# Altium schematic sheet 01-POWER.SchDoc: *NGUON4V4
size A4; SheetNumber: 1; SheetTotal: 4
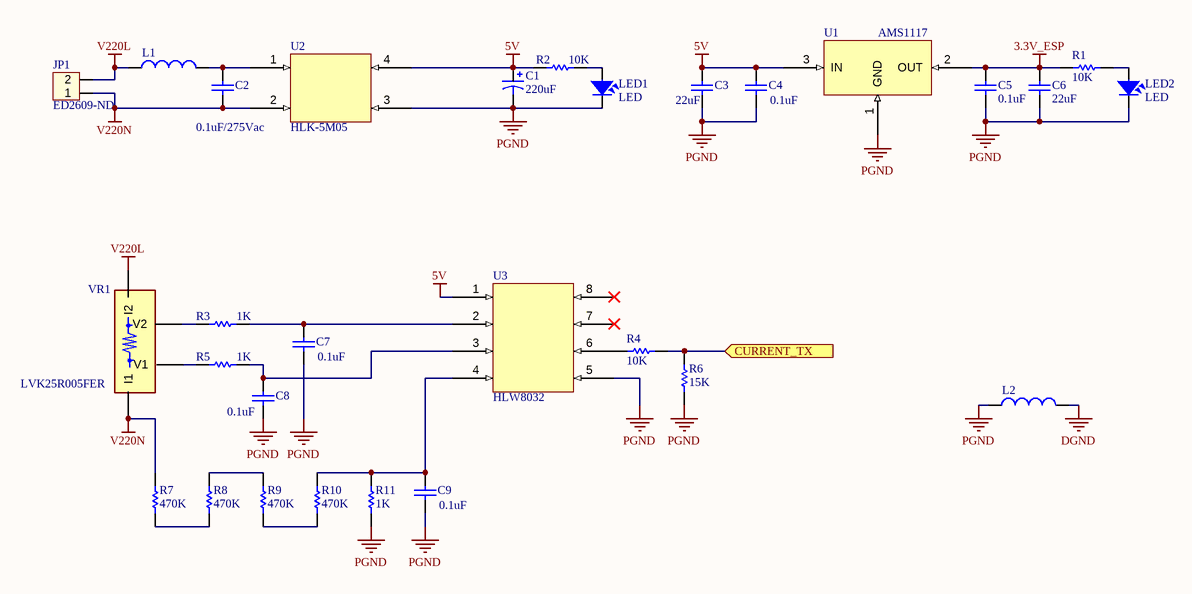
[diagram p0: 01-POWER.SchDoc]

## Parts
C1  220uF  [CAP ALU CASE G SMD]
C2  0.1uF/275Vac  [FilM_Cap]
C3  22uF  [CAP_CERA_C2012(CC0805INCH)]
C4  0.1uF  [CAP_CERA_C2012(CC0805INCH)]
C5  0.1uF  [CAP_CERA_C2012(CC0805INCH)]
C6  22uF  [CAP_CERA_C2012(CC0805INCH)]
C7  0.1uF  [Cap Ceramic 0603 SMD]
C8  0.1uF  [Cap Ceramic 0603 SMD]
C9  0.1uF  [Cap Ceramic 0603 SMD]
JP1  ED2609-ND  [DOMINO_OSTTC_2P]
L1  744212820  [WE-SL1]  (value not drawn)
L2  ASPI-7318-8R2M-TCT-ND  [ASPI-7318-8R2M-TCT-ND]  (value not drawn)
LED1  LED  [Led 0805G]
LED2  LED  [Led 0805G]
R1  10K  [Res 0603 SMD]
R2  10K  [Res 0603 SMD]
R3  1K  [Res 0603 SMD]
R4  10K  [Res 0603 SMD]
R5  1K  [Res 0603 SMD]
R6  15K  [Res 0603 SMD]
R7  470K  [Res 0603 SMD]
R8  470K  [Res 0603 SMD]
R9  470K  [Res 0603 SMD]
R10  470K  [Res 0603 SMD]
R11  1K  [Res 0603 SMD]
U1  AMS1117  [SOT230P700X180-4N]
U2  HLK-5M05  [CONV_HLK-5M05]
U3  HLW8032  [SOIC127P600X175-8N]
VR1  LVK25R005FER  [LVK25R005FER]

## Ports
CURRENT_TX (in)

## Nets
3.3V_ESP: C5.2 C6.2 R1.1 U1.2(OUT)
5V: C1.1 C3.2 C4.2 R2.1 U1.3(IN) U2.4 U3.1
DGND: L2.2
PGND: C1.2 C3.1 C4.1 C5.1 C6.1 C7.1 C8.1 C9.1 L2.1 LED1.2 LED2.2 R6.2 R11.1 U1.1(GND) U2.3 U3.5
V220L: JP1.2 L1.1 VR1.2(I2)
V220N: C2.1 JP1.1 R7.1 U2.2 VR1.1(I1)
CURRENT_TX: R4.2 R6.1 ; port CURRENT_TX
NetC2_2: C2.2 L1.2 U2.1
NetC7_2: C7.2 R3.1 U3.2
NetC8_2: C8.2 R5.1 U3.3
NetC9_2: C9.2 R10.1 R11.2 U3.4
NetLED1_1: LED1.1 R2.2
NetLED2_1: LED2.1 R1.2
NetR3_2: R3.2 VR1.4(V2)
NetR4_1: R4.1 U3.6
NetR5_2: R5.2 VR1.3(V1)
NetR7_2: R7.2 R8.2
NetR8_1: R8.1 R9.1
NetR9_2: R9.2 R10.2

Not connected (* = marked no-connect by the designer): U3 7* 8*

## Notes on the sheet
- DWG. NO.
- REV.
- SHT.
- THIS DOCUMENT AND THE DATA DISCLOSED HEREIN OR HEREWITH IS THE PROPERTY OF ALTIUM LIMITED AND MAY BE FREELY DISTRIBUTED IN WHOLE. NO RIGHTS ARE RESERVED OR EXPRESS OR IMPLIED WARANTEE GIVEN.
- REVISION
- DESCRIPTION
- DATE
- APPROVED
- ENG:
- APPROVALS
- PROJECT
- DSN:
- CHK:
- REFERENCE DOCUMENTS
- PROJECT REVISION:
- TITLE
- DOCUMENT REVISION:
- DESIGN ITEM:
- BOM:
- FAB DWG:
- PCB DWG:
- ASSY DWG:
- SCALE:
- SIZE
- B
- CAGE CODE
- FILE NAME
- DWG NO.
- SHEET
- OF
- REV

## Library data of the parts
C1 = 330uF/50V/ALU12.5X20mm/20%/7000Hrs: CAP ALU 220UF 20% 50V SMD; Manufacturer: Nichicon; Manufacturer Part Number: UPW1J331MHD; Lifetime @ Temp.: 7000 Hrs @ 105°C; Polarization: Polar; Ripple Current - Low Frequency: 838.5mA @ 120Hz; Ripple Current - High Frequency: 1.29A @ 100kHz; RoHS: RoHS Compliant; Category: Capacitors; Packaging: Bulk; Part Status: Active; Tolerance: ±20%; ESR (Equivalent Series Resistance): -; Operating Temperature: -55°C ~ 105°C; Applications: General Purpose; Lead Spacing: 0.197" (5.00mm); Size / Dimension: 0.492" Dia (12.50mm); Height - Seated (Max): 0.787" (20.00mm); Surface Mount Land Size: -; Mounting Type: Through Hole; Package / Case: Radial, Can; ComponentLink1URL: http://nichicon-us.com/english/products/pdfs/e-upw.pdf; ComponentLink1Description: http://nichicon-us.com/english/products/pdfs/e-upw.pdf; Supplier 1: Digi-Key; Supplier Part Number 1: PCE5121TR-ND
C2 = 0.1uF/50V/C0603/10%: 0.1 µF Film Capacitor 275V - Polypropylene (PP), Metallized Radial; Manufacturer: Murata; ComponentLink1URL: http://www.murata.com/~/media/webrenewal/support/library/catalog/products/capacitor/mlcc/c02e.ashx; ComponentLink1Description: http://www.murata.com/~/media/webrenewal/support/library/catalog/products/capacitor/mlcc/c02e.ashx; Digikey: 490-9961-1-ND
C3 C6 = 0.1uF/50V/C0603/10%: 22µF ±20% 25V Ceramic Capacitor X5R 0805 (2012 Metric); Manufacturer: Tariff Applied; ComponentLink1URL: http://www.murata.com/~/media/webrenewal/support/library/catalog/products/capacitor/mlcc/c02e.ashx; ComponentLink1Description: http://www.murata.com/~/media/webrenewal/support/library/catalog/products/capacitor/mlcc/c02e.ashx; Digikey: 1276-2908-1-ND
C4 C5 = 0.1uF/50V/C0603/10%: 0.1µF ±10% 25V Ceramic Capacitor X7R 0805 (2012 Metric); ComponentLink1URL: http://www.murata.com/~/media/webrenewal/support/library/catalog/products/capacitor/mlcc/c02e.ashx; ComponentLink1Description: http://www.murata.com/~/media/webrenewal/support/library/catalog/products/capacitor/mlcc/c02e.ashx; Digikey: 478-3755-1-ND
C7-C9 = 0.1uF/50V/C0603/10%: CAP CER 0.1UF 50V 10% X7R 0603; Manufacturer: Murata Electronics North America; Manufacturer Part Number: GRM188R71H104KA93D; Capacitance: 0.1µF; RoHS: RoHS Compliant; Category: Capacitors; Packaging: Tape & Reel (TR); Tolerance: ±10%; Voltage - Rated: 50V; Temperature Coefficient: X7R; Mounting Type: Surface Mount, MLCC; Operating Temperature: -55°C ~ 125°C; Applications: General Purpose; Ratings: -; Package / Case: 0603 (1608 Metric); Size / Dimension: 0.063" L x 0.031" W (1.60mm x 0.80mm); Height - Seated (Max): -; Thickness (Max): 0.035" (0.90mm); Lead Spacing: -; Features: -; Lead Style: -; ComponentLink1URL: http://www.murata.com/~/media/webrenewal/support/library/catalog/products/capacitor/mlcc/c02e.ashx; ComponentLink1Description: http://www.murata.com/~/media/webrenewal/support/library/catalog/products/capacitor/mlcc/c02e.ashx; Supplier 1: Digi-Key; Supplier Part Number 1: 490-1519-1-ND
JP1 = Con2: 2 Position Wire to Board Terminal Block Horizontal with Board 0.200" (5.08mm) Through Hole; Value: Connector 2; Digikey: ED2609-ND
L1 L2 = Inductor: Sensible value10-15mH，current / 70-500mA; Digikey: ASPI-7318-8R2M-TCT-ND
LED1 LED2 = LED: LED Single colour Green and Red; Value: LED 3 ly Single Colour
R1 R2 R4 = 15K/R0603/1%: RES SMD 10K OHM 1% 1/10W 0603; Manufacturer: Yageo; Manufacturer Part Number: RC0603FR-0715KL; Resistance (Ohms): 15k; Power (Watts): 0.1W, 1/10W; Temperature Coefficient: ±100ppm/°C; RoHS: RoHS Compliant; Category: Resistors; Packaging: Digi-Reel®; Tolerance: ±1%; Composition: Thick Film; Features: Moisture Resistant; Operating Temperature: -55°C ~ 155°C; Package / Case: 0603 (1608 Metric); Supplier Device Package: 0603; Size / Dimension: 0.063" L x 0.031" W (1.60mm x 0.80mm); Height: 0.022" (0.55mm); Number of Terminations: 2; ComponentLink1URL: http://www.yageo.com/NewPortal/yageodocoutput?fileName=/pdf/R-Chip/PYu-RC_Group_51_RoHS_L_3.pdf; ComponentLink1Description: http://www.yageo.com/NewPortal/yageodocoutput?fileName=/pdf/R-Chip/PYu-RC_Group_51_RoHS_L_3.pdf; Supplier 1: Digi-Key; Supplier Part Number 1: 311-15.0KHRCT-ND
R3 R5 R11 = 15K/R0603/1%: RES SMD 1K OHM 1% 1/10W 0603; Manufacturer: Yageo; Manufacturer Part Number: RC0603FR-0715KL; Resistance (Ohms): 15k; Power (Watts): 0.1W, 1/10W; Temperature Coefficient: ±100ppm/°C; RoHS: RoHS Compliant; Category: Resistors; Packaging: Digi-Reel®; Tolerance: ±1%; Composition: Thick Film; Features: Moisture Resistant; Operating Temperature: -55°C ~ 155°C; Package / Case: 0603 (1608 Metric); Supplier Device Package: 0603; Size / Dimension: 0.063" L x 0.031" W (1.60mm x 0.80mm); Height: 0.022" (0.55mm); Number of Terminations: 2; ComponentLink1URL: http://www.yageo.com/NewPortal/yageodocoutput?fileName=/pdf/R-Chip/PYu-RC_Group_51_RoHS_L_3.pdf; ComponentLink1Description: http://www.yageo.com/NewPortal/yageodocoutput?fileName=/pdf/R-Chip/PYu-RC_Group_51_RoHS_L_3.pdf; Supplier 1: Digi-Key; Supplier Part Number 1: 311-15.0KHRCT-ND
R6 = 15K/R0603/1%: RES SMD 15K OHM 1% 1/10W 0603; Manufacturer: Yageo; Manufacturer Part Number: RC0603FR-0715KL; Power (Watts): 0.1W, 1/10W; Temperature Coefficient: ±100ppm/°C; RoHS: RoHS Compliant; Category: Resistors; Packaging: Digi-Reel®; Resistance (Ohms): 15k; Tolerance: ±1%; Composition: Thick Film; Features: Moisture Resistant; Operating Temperature: -55°C ~ 155°C; Package / Case: 0603 (1608 Metric); Supplier Device Package: 0603; Size / Dimension: 0.063" L x 0.031" W (1.60mm x 0.80mm); Height: 0.022" (0.55mm); Number of Terminations: 2; ComponentLink1URL: http://www.yageo.com/NewPortal/yageodocoutput?fileName=/pdf/R-Chip/PYu-RC_Group_51_RoHS_L_3.pdf; ComponentLink1Description: http://www.yageo.com/NewPortal/yageodocoutput?fileName=/pdf/R-Chip/PYu-RC_Group_51_RoHS_L_3.pdf; Supplier 1: Digi-Key; Supplier Part Number 1: 311-15.0KHRCT-ND
R7-R10 = 15K/R0603/1%: RES SMD 470K OHM 1% 1/10W 0603; Manufacturer: Yageo; Manufacturer Part Number: RC0603FR-0715KL; Resistance (Ohms): 15k; Power (Watts): 0.1W, 1/10W; Temperature Coefficient: ±100ppm/°C; RoHS: RoHS Compliant; Category: Resistors; Packaging: Digi-Reel®; Tolerance: ±1%; Composition: Thick Film; Features: Moisture Resistant; Operating Temperature: -55°C ~ 155°C; Package / Case: 0603 (1608 Metric); Supplier Device Package: 0603; Size / Dimension: 0.063" L x 0.031" W (1.60mm x 0.80mm); Height: 0.022" (0.55mm); Number of Terminations: 2; ComponentLink1URL: http://www.yageo.com/NewPortal/yageodocoutput?fileName=/pdf/R-Chip/PYu-RC_Group_51_RoHS_L_3.pdf; ComponentLink1Description: http://www.yageo.com/NewPortal/yageodocoutput?fileName=/pdf/R-Chip/PYu-RC_Group_51_RoHS_L_3.pdf; Supplier 1: Digi-Key; Supplier Part Number 1: 311-15.0KHRCT-ND
VR1 = LVK25R005FER: Resistor; Manufacturer_Name: Ohmite; Allied_Number: 70024671; Datasheet Link: http://www.ohmite.com/assets/docs/res_lvk.pdf; Height: 0mm; Manufacturer_Part_Number: LVK25R005FER; Mouser Part Number: 588-LVK25R005FER; Mouser Price/Stock: https://www.mouser.com/Search/Refine.aspx?Keyword=588-LVK25R005FER; RS Part Number: 8934005; RS Price/Stock: http://uk.rs-online.com/web/p/products/8934005; Allied Price/Stock: https://www.alliedelec.com/ohmite-lvk25r005fer/70024671/